# Altium schematic sheet bb_optocouplers3.SchDoc
size A4; SheetNumber: 6; SheetTotal: 6
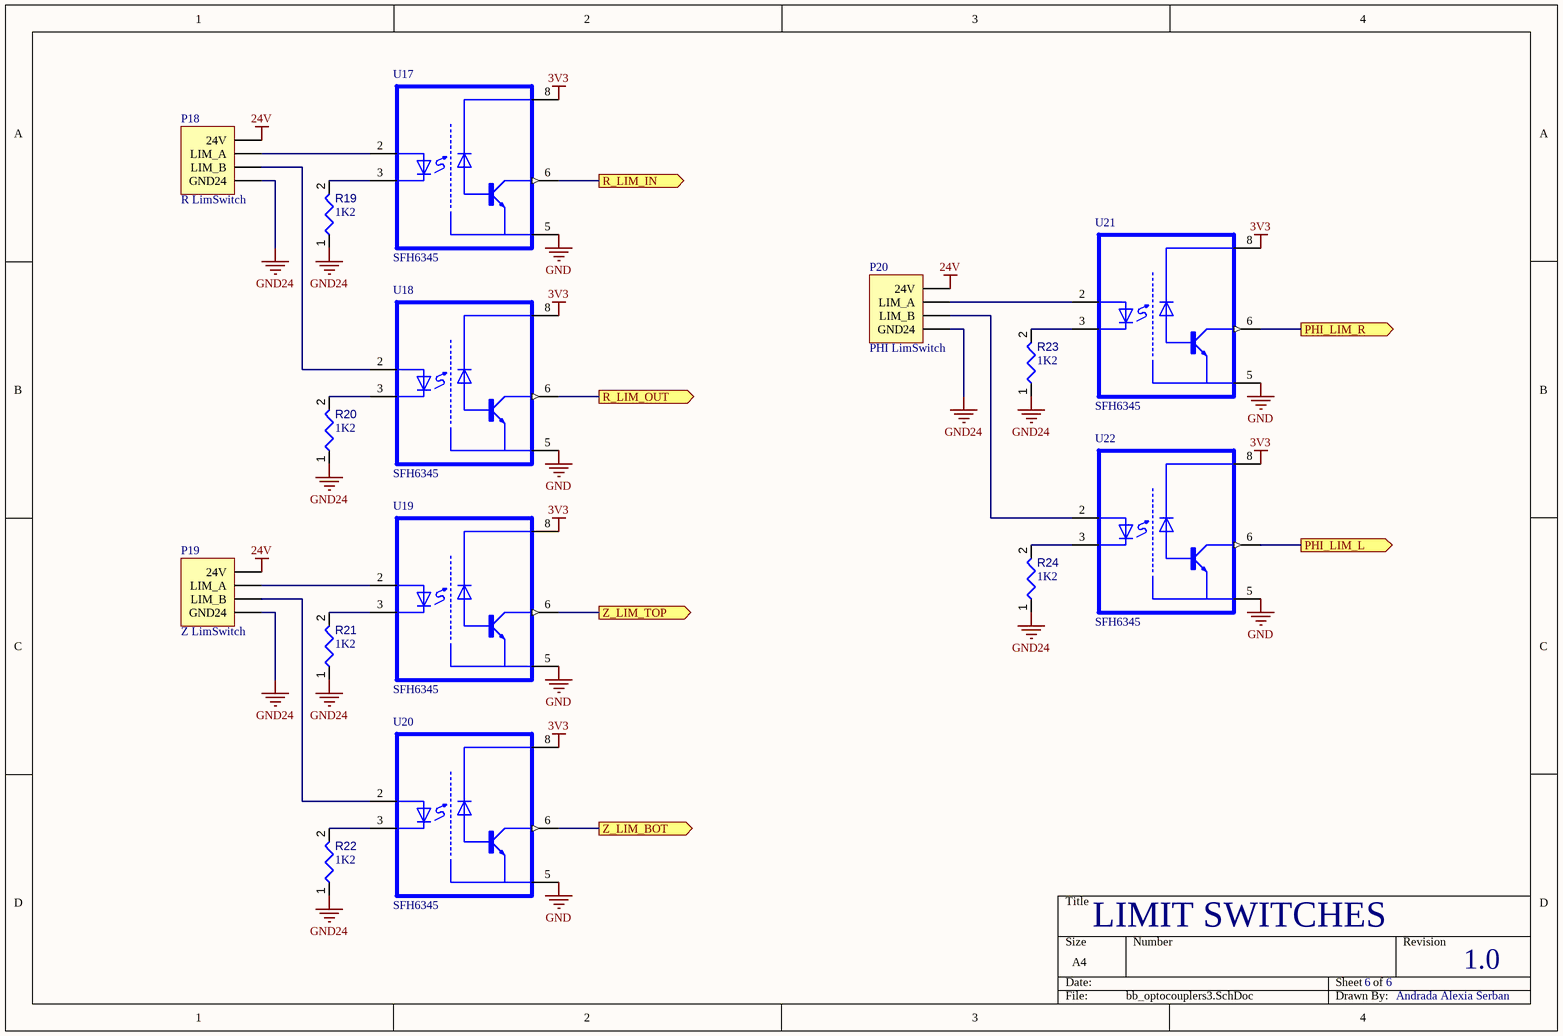
[diagram p0: bb_optocouplers3.SchDoc]

## Parts
P18  R LimSwitch  [FP_CONN4_TAP_254MM]
P19  Z LimSwitch  [FP_CONN4_TAP_254MM]
P20  PHI LimSwitch  [FP_CONN4_TAP_254MM]
R19  value 1K2  [RESC0402(1005)_L]  (hidden comment: Resistor 200R +/-5 % 0402 63 mW)
R20  value 1K2  [RESC0402(1005)_L]  (hidden comment: Resistor 200R +/-5 % 0402 63 mW)
R21  value 1K2  [RESC0402(1005)_L]  (hidden comment: Resistor 200R +/-5 % 0402 63 mW)
R22  value 1K2  [RESC0402(1005)_L]  (hidden comment: Resistor 200R +/-5 % 0402 63 mW)
R23  value 1K2  [RESC0402(1005)_L]  (hidden comment: Resistor 200R +/-5 % 0402 63 mW)
R24  value 1K2  [RESC0402(1005)_L]  (hidden comment: Resistor 200R +/-5 % 0402 63 mW)
U17  SFH6345  [DIP762W50P254L977H451Q8]
U18  SFH6345  [DIP762W50P254L977H451Q8]
U19  SFH6345  [DIP762W50P254L977H451Q8]
U20  SFH6345  [DIP762W50P254L977H451Q8]
U21  SFH6345  [DIP762W50P254L977H451Q8]
U22  SFH6345  [DIP762W50P254L977H451Q8]

## Ports
PHI_LIM_L (out, see bb_Nucleo[3A]), PHI_LIM_R (out, see bb_Nucleo[3A]), R_LIM_IN (out, see bb_Nucleo[3A]), R_LIM_OUT (out, see bb_Nucleo[3A]), Z_LIM_BOT (out, see bb_Nucleo[3A]), Z_LIM_TOP (out, see bb_Nucleo[3A])

## Nets
3V3: U17.8(VCC) U18.8(VCC) U19.8(VCC) U20.8(VCC) U21.8(VCC) U22.8(VCC)
24V: P18.4(24V) P19.4(24V) P20.4(24V)
GND: U17.5(E) U18.5(E) U19.5(E) U20.5(E) U21.5(E) U22.5(E)
GND24: P18.1(GND24) P19.1(GND24) P20.1(GND24) R19.1 R20.1 R21.1 R22.1 R23.1 R24.1
PHI_LIM_L: U22.6(CO) ; port PHI_LIM_L
PHI_LIM_R: U21.6(CO) ; port PHI_LIM_R
R_LIM_IN: U17.6(CO) ; port R_LIM_IN
R_LIM_OUT: U18.6(CO) ; port R_LIM_OUT
Z_LIM_BOT: U20.6(CO) ; port Z_LIM_BOT
Z_LIM_TOP: U19.6(CO) ; port Z_LIM_TOP
NetP18_2: P18.2(LIM_B) U18.2(A)
NetP18_3: P18.3(LIM_A) U17.2(A)
NetP19_2: P19.2(LIM_B) U20.2(A)
NetP19_3: P19.3(LIM_A) U19.2(A)
NetP20_2: P20.2(LIM_B) U22.2(A)
NetP20_3: P20.3(LIM_A) U21.2(A)
NetR19_2: R19.2 U17.3(C)
NetR20_2: R20.2 U18.3(C)
NetR21_2: R21.2 U19.3(C)
NetR22_2: R22.2 U20.3(C)
NetR23_2: R23.2 U21.3(C)
NetR24_2: R24.2 U22.3(C)

## Notes on the sheet
- LIMIT SWITCHES
- 6
- 1.0
- Andrada Alexia Serban

## Library data of the parts
P18-P20 = Connector_4pin: 4pin Connector
R19-R24 = CMP-009-00161-3: Chip Resistor, 200 Ohms, +/-5 %, 63 mW, -55 to 155 degC, 0402; Power: 63mW; Tolerance: 5%; Min Operating Temperature: -55°C; Case/Package: 0402; Max Operating Temperature: 155°C; Pins: 2
U17-U22 = CMP-013-000000-1: Analog High Speed Coupler, High Noise Immunity, 1 MBd, 15 kV/ÎĽs; Pin Count: 5; Source: SFH6345.SchLib; MP: SFH6345; Design Item ID: SFH6345; Price: None; Availability: Unavailable; Component Type: Standard; Package: None; Value: *